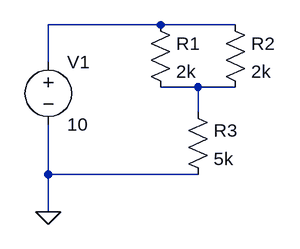
[diagram p0: schematic mixed_series_parallel.asc]
mixed_series_parallel.asc, the LTspice schematic file:
Version 4
SHEET 1 880 680
WIRE 240 64 96 64
WIRE 336 64 240 64
WIRE 96 112 96 64
WIRE 288 144 240 144
WIRE 336 144 288 144
WIRE 288 176 288 144
WIRE 96 256 96 192
WIRE 288 256 96 256
WIRE 96 304 96 256
FLAG 96 304 0
SYMBOL voltage 96 96 R0
WINDOW 123 0 0 Left 0
WINDOW 39 0 0 Left 0
SYMATTR InstName V1
SYMATTR Value 10
SYMBOL res 224 48 R0
SYMATTR InstName R1
SYMATTR Value 2k
SYMBOL res 320 48 R0
SYMATTR InstName R2
SYMATTR Value 2k
SYMBOL res 272 160 R0
SYMATTR InstName R3
SYMATTR Value 5k

The netlist it stands for:
* mixed_series_parallel.asc
V1 N001 0 10
R1 N001 N002 2k
R2 N001 N002 2k
R3 N002 0 5k
.backanno
.end